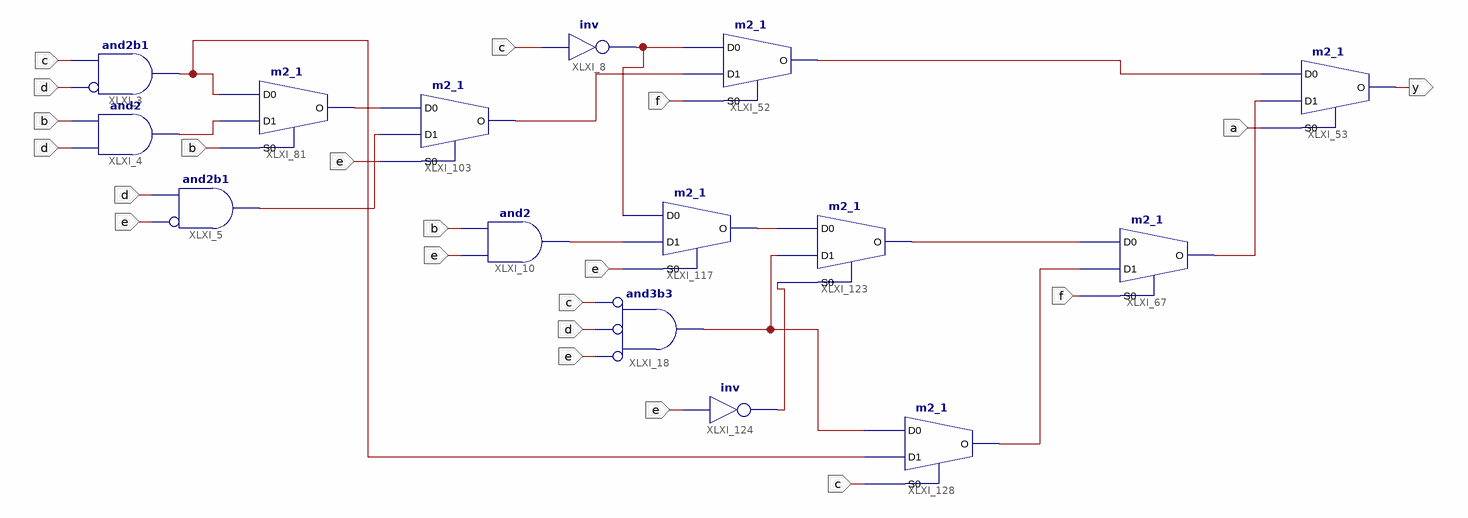
[diagram p0: schematic sheet 1]
// Xilinx ISE schematic MUX2.sch (spartan6) as structural Verilog: 15 symbols, 7 ports
module MUX2 (
  input  f,
  input  d,
  input  b,
  input  e,
  input  c,
  input  a,
  output y
);

  wire XLXN_133, XLXN_169, XLXN_220, XLXN_238, XLXN_239, XLXN_282, XLXN_283, XLXN_311, XLXN_328, XLXN_338,
       XLXN_339, XLXN_341, XLXN_347, XLXN_355;

  m2_1 XLXI_52 (.D0(XLXN_133), .D1(XLXN_311), .S0(f), .O(XLXN_169));
  m2_1 XLXI_81 (.D0(XLXN_238), .D1(XLXN_239), .S0(b), .O(XLXN_282));
  and XLXI_3 (XLXN_238, ~d, c);  // and2b1
  and XLXI_4 (XLXN_239, d, b);
  and XLXI_5 (XLXN_283, ~e, d);  // and2b1
  m2_1 XLXI_103 (.D0(XLXN_282), .D1(XLXN_283), .S0(e), .O(XLXN_311));
  m2_1 XLXI_117 (.D0(XLXN_133), .D1(XLXN_328), .S0(e), .O(XLXN_339));
  not XLXI_8 (XLXN_133, c);
  and XLXI_10 (XLXN_328, e, b);
  m2_1 XLXI_123 (.D0(XLXN_339), .D1(XLXN_338), .S0(XLXN_341), .O(XLXN_347));
  and XLXI_18 (XLXN_338, ~e, ~d, ~c);  // and3b3
  not XLXI_124 (XLXN_341, e);
  m2_1 XLXI_128 (.D0(XLXN_338), .D1(XLXN_238), .S0(c), .O(XLXN_355));
  m2_1 XLXI_53 (.D0(XLXN_169), .D1(XLXN_220), .S0(a), .O(y));
  m2_1 XLXI_67 (.D0(XLXN_347), .D1(XLXN_355), .S0(f), .O(XLXN_220));
endmodule
